# Altium schematic sheet analog_dac.SchDoc
size A3
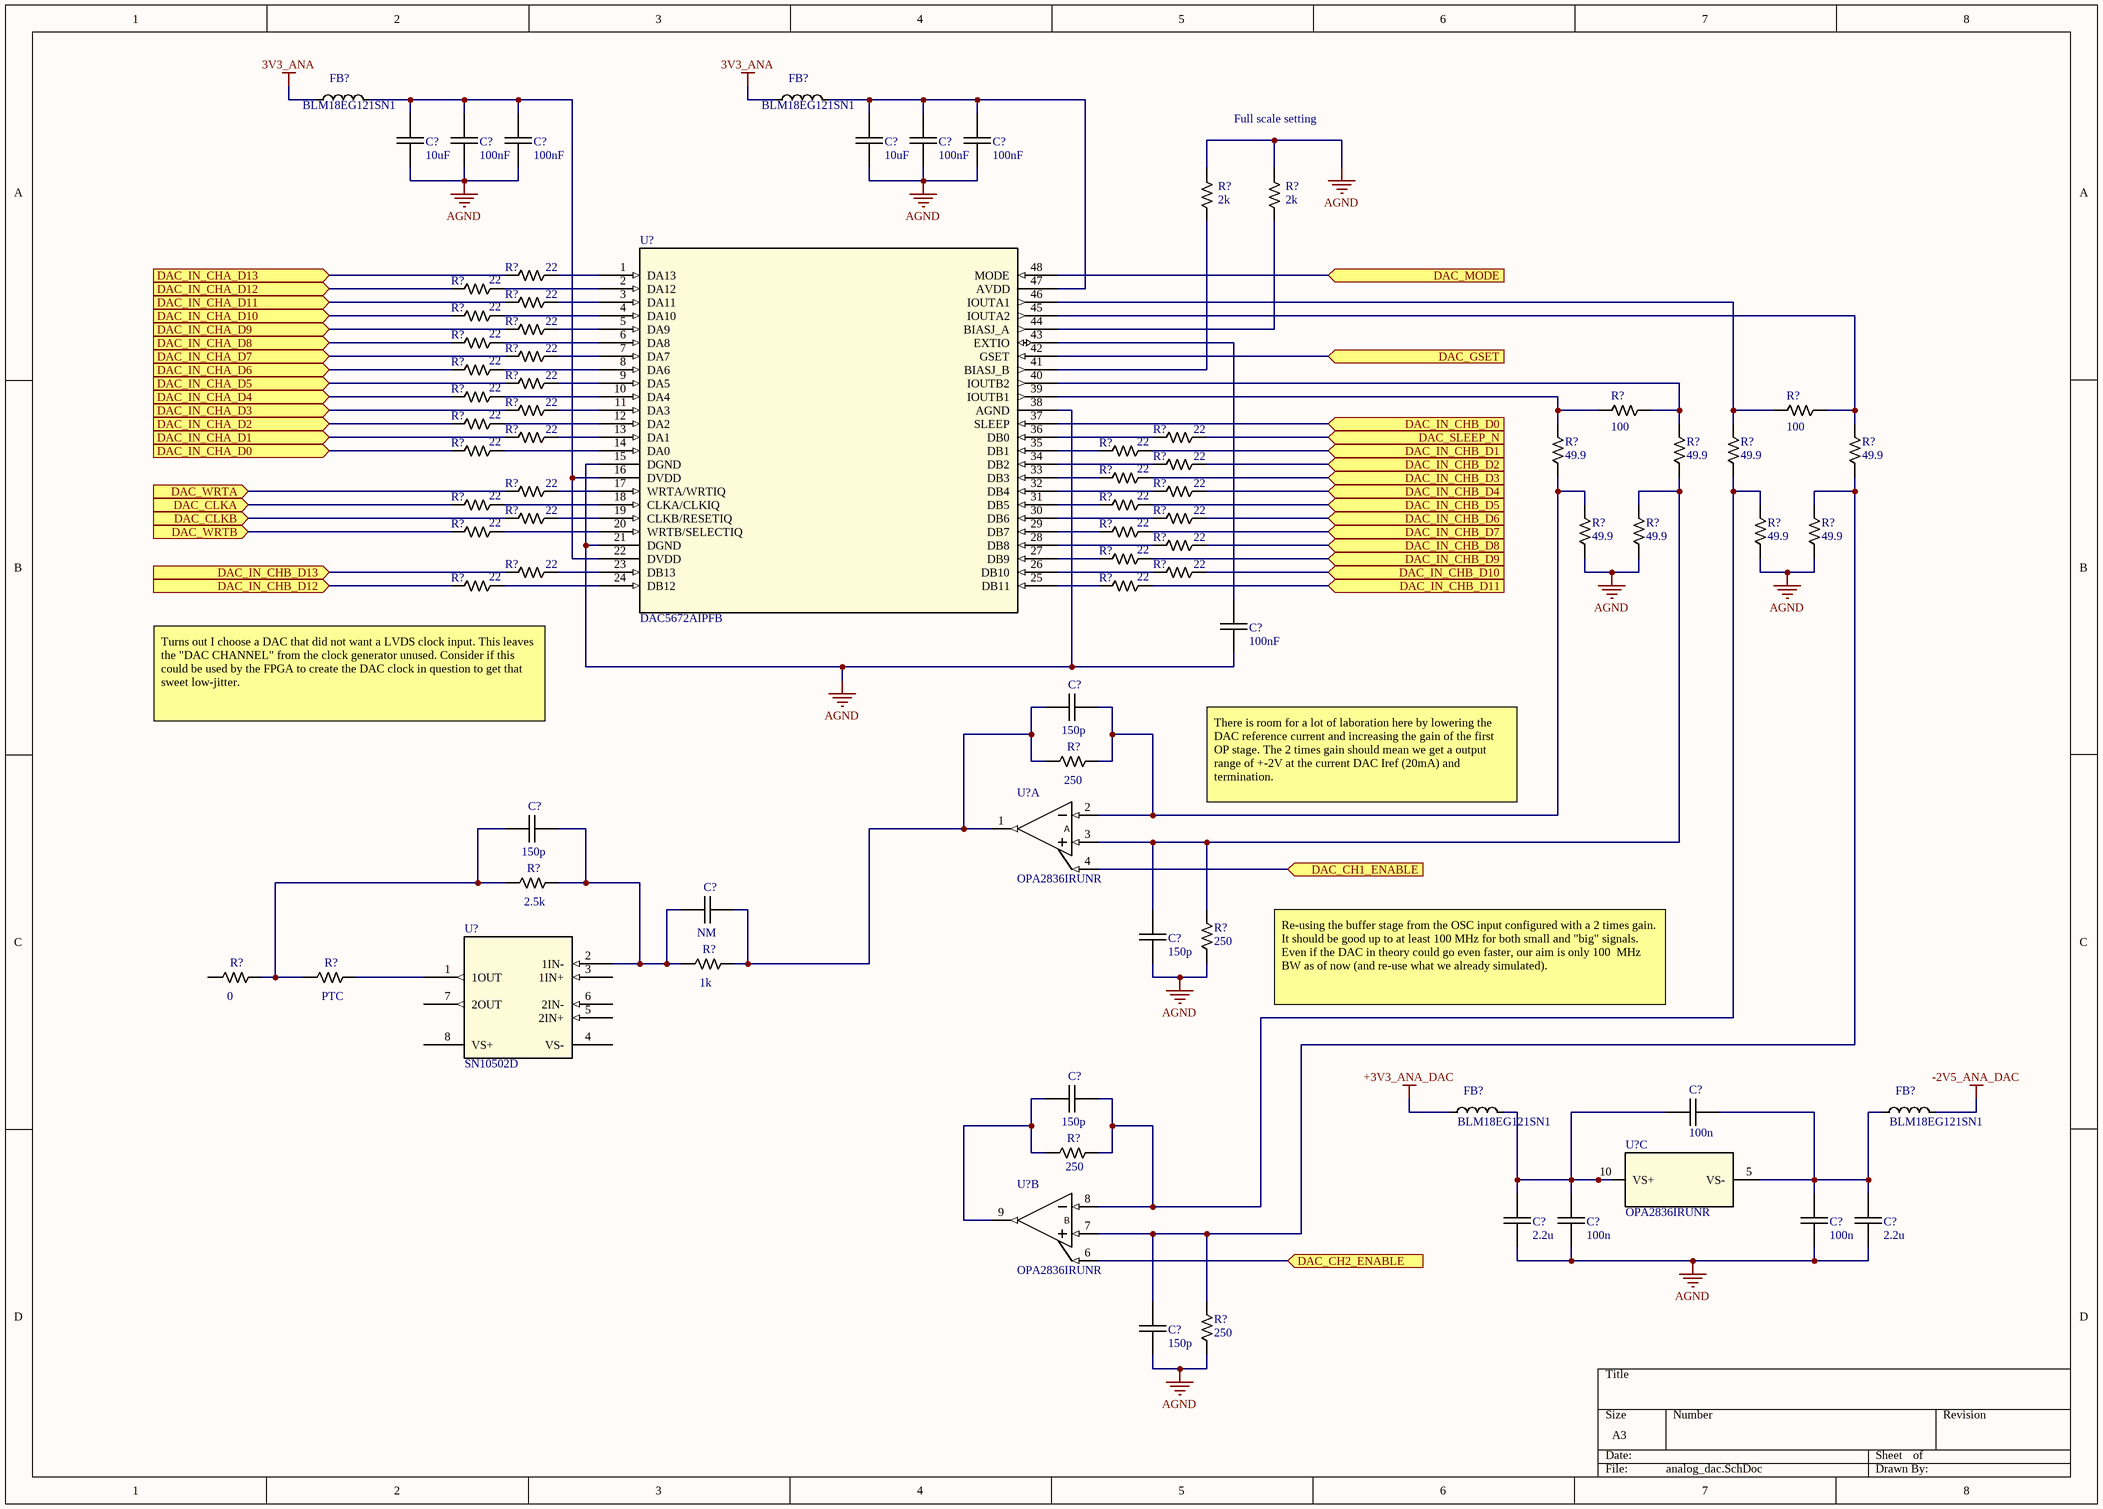
[diagram p0: analog_dac.SchDoc]

## Parts
(Parts that share a designator on the sheet are numbered #1, #2 ... from top to bottom, then left to right.)
C?#1  value 10uF  [CAPC2012X14N]  (hidden comment: MLLC Capacitor)
C?#2  value 100nF  [CAPC1005X06N]  (hidden comment: MLLC Capacitor)
C?#3  value 100nF  [CAPC1005X06N]  (hidden comment: MLLC Capacitor)
C?#4  value 10uF  [CAPC2012X14N]  (hidden comment: MLLC Capacitor)
C?#5  value 100nF  [CAPC1005X06N]  (hidden comment: MLLC Capacitor)
C?#6  value 100nF  [CAPC1005X06N]  (hidden comment: MLLC Capacitor)
C?#7  value 100nF  [CAPC1005X06N]  (hidden comment: MLLC Capacitor)
C?#8  value 150p  [CAPC1005X06N]  (hidden comment: MLLC Capacitor)
C?#9  value 150p  [CAPC1005X06N]  (hidden comment: MLLC Capacitor)
C?#10  value NM  [CAPC1005X06N]  (hidden comment: MLLC Capacitor)
C?#11  value 150p  [CAPC1005X06N]  (hidden comment: MLLC Capacitor)
C?#12  value 150p  [CAPC1005X06N]  (hidden comment: MLLC Capacitor)
C?#13  value 100n  [CAPC1005X06N]  (hidden comment: MLLC Capacitor)
C?#14  value 2.2u  [CAPC1005X06N]  (hidden comment: MLLC Capacitor)
C?#15  value 100n  [CAPC1005X06N]  (hidden comment: MLLC Capacitor)
C?#16  value 100n  [CAPC1005X06N]  (hidden comment: MLLC Capacitor)
C?#17  value 2.2u  [CAPC1005X06N]  (hidden comment: MLLC Capacitor)
C?#18  value 150p  [CAPC1005X06N]  (hidden comment: MLLC Capacitor)
FB?#1  value BLM18EG121SN1  [INDC1608X08N]  (hidden comment: Chip Inductor)
FB?#2  value BLM18EG121SN1  [INDC1608X08N]  (hidden comment: Chip Inductor)
FB?#3  value BLM18EG121SN1  [INDC1608X08N]  (hidden comment: Chip Inductor)
FB?#4  value BLM18EG121SN1  [INDC1608X08N]  (hidden comment: Chip Inductor)
R?#1  value 2k  [RESC1005X04N]  (hidden comment: Chip Resistor)
R?#2  value 2k  [RESC1005X04N]  (hidden comment: Chip Resistor)
R?#3  value 22  [RESC1005X04N]  (hidden comment: Chip Resistor)
R?#4  value 22  [RESC1005X04N]  (hidden comment: Chip Resistor)
R?#5  value 22  [RESC1005X04N]  (hidden comment: Chip Resistor)
R?#6  value 22  [RESC1005X04N]  (hidden comment: Chip Resistor)
R?#7  value 22  [RESC1005X04N]  (hidden comment: Chip Resistor)
R?#8  value 22  [RESC1005X04N]  (hidden comment: Chip Resistor)
R?#9  value 22  [RESC1005X04N]  (hidden comment: Chip Resistor)
R?#10  value 22  [RESC1005X04N]  (hidden comment: Chip Resistor)
R?#11  value 22  [RESC1005X04N]  (hidden comment: Chip Resistor)
R?#12  value 22  [RESC1005X04N]  (hidden comment: Chip Resistor)
R?#13  value 22  [RESC1005X04N]  (hidden comment: Chip Resistor)
R?#14  value 100  [RESC1005X04N]  (hidden comment: Chip Resistor)
R?#15  value 100  [RESC1005X04N]  (hidden comment: Chip Resistor)
R?#16  value 22  [RESC1005X04N]  (hidden comment: Chip Resistor)
R?#17  value 22  [RESC1005X04N]  (hidden comment: Chip Resistor)
R?#18  value 22  [RESC1005X04N]  (hidden comment: Chip Resistor)
R?#19  value 22  [RESC1005X04N]  (hidden comment: Chip Resistor)
R?#20  value 22  [RESC1005X04N]  (hidden comment: Chip Resistor)
R?#21  value 49.9  [RESC1005X04N]  (hidden comment: Chip Resistor)
R?#22  value 49.9  [RESC1005X04N]  (hidden comment: Chip Resistor)
R?#23  value 49.9  [RESC1005X04N]  (hidden comment: Chip Resistor)
R?#24  value 49.9  [RESC1005X04N]  (hidden comment: Chip Resistor)
R?#25  value 22  [RESC1005X04N]  (hidden comment: Chip Resistor)
R?#26  value 22  [RESC1005X04N]  (hidden comment: Chip Resistor)
R?#27  value 22  [RESC1005X04N]  (hidden comment: Chip Resistor)
R?#28  value 22  [RESC1005X04N]  (hidden comment: Chip Resistor)
R?#29  value 22  [RESC1005X04N]  (hidden comment: Chip Resistor)
R?#30  value 22  [RESC1005X04N]  (hidden comment: Chip Resistor)
R?#31  value 22  [RESC1005X04N]  (hidden comment: Chip Resistor)
R?#32  value 22  [RESC1005X04N]  (hidden comment: Chip Resistor)
R?#33  value 22  [RESC1005X04N]  (hidden comment: Chip Resistor)
R?#34  value 22  [RESC1005X04N]  (hidden comment: Chip Resistor)
R?#35  value 49.9  [RESC1005X04N]  (hidden comment: Chip Resistor)
R?#36  value 49.9  [RESC1005X04N]  (hidden comment: Chip Resistor)
R?#37  value 49.9  [RESC1005X04N]  (hidden comment: Chip Resistor)
R?#38  value 49.9  [RESC1005X04N]  (hidden comment: Chip Resistor)
R?#39  value 22  [RESC1005X04N]  (hidden comment: Chip Resistor)
R?#40  value 22  [RESC1005X04N]  (hidden comment: Chip Resistor)
R?#41  value 22  [RESC1005X04N]  (hidden comment: Chip Resistor)
R?#42  value 22  [RESC1005X04N]  (hidden comment: Chip Resistor)
R?#43  value 22  [RESC1005X04N]  (hidden comment: Chip Resistor)
R?#44  value 22  [RESC1005X04N]  (hidden comment: Chip Resistor)
R?#45  value 250  [RESC1005X04N]  (hidden comment: Chip Resistor)
R?#46  value 2.5k  [RESC1005X04N]  (hidden comment: Chip Resistor)
R?#47  value 250  [RESC1005X04N]  (hidden comment: Chip Resistor)
R?#48  value 1k  [RESC1005X04N]  (hidden comment: Chip Resistor)
R?#49  value 0  [RESC1005X04N]  (hidden comment: Chip Resistor)
R?#50  value PTC  [RESC1005X04N]  (hidden comment: Chip Resistor)
R?#51  value 250  [RESC1005X04N]  (hidden comment: Chip Resistor)
R?#52  value 250  [RESC1005X04N]  (hidden comment: Chip Resistor)
U?#1  DAC5672AIPFB  [PFB48]
U?#2  OPA2836IRUNR  [RUN0010A]  (part A of 3)
U?#3  SN10502D  [D8]
U?#4  OPA2836IRUNR  [RUN0010A]  (part C of 3)
U?#5  OPA2836IRUNR  [RUN0010A]  (part B of 3)

## Ports
DAC_CH1_ENABLE (in), DAC_CH2_ENABLE (in), DAC_CLKA (in), DAC_CLKB (in), DAC_GSET (in), DAC_IN_CHA_D0 (in), DAC_IN_CHA_D1 (in), DAC_IN_CHA_D2 (in), DAC_IN_CHA_D3 (in), DAC_IN_CHA_D4 (in), DAC_IN_CHA_D5 (in), DAC_IN_CHA_D6 (in), DAC_IN_CHA_D7 (in), DAC_IN_CHA_D8 (in), DAC_IN_CHA_D9 (in), DAC_IN_CHA_D10 (in), DAC_IN_CHA_D11 (in), DAC_IN_CHA_D12 (in), DAC_IN_CHA_D13 (in), DAC_IN_CHB_D0 (in), DAC_IN_CHB_D1 (in), DAC_IN_CHB_D2 (in), DAC_IN_CHB_D3 (in), DAC_IN_CHB_D4 (in), DAC_IN_CHB_D5 (in), DAC_IN_CHB_D6 (in), DAC_IN_CHB_D7 (in), DAC_IN_CHB_D8 (in), DAC_IN_CHB_D9 (in), DAC_IN_CHB_D10 (in), DAC_IN_CHB_D11 (in), DAC_IN_CHB_D12 (in), DAC_IN_CHB_D13 (in), DAC_MODE (in), DAC_SLEEP_N (in), DAC_WRTA (in), DAC_WRTB (in)

## Nets
3V3_ANA: FB?#1.1 FB?#2.1
+3V3_ANA_DAC: FB?#3.1
-2V5_ANA_DAC: FB?#4.2
AGND: C?#1.2 C?#2.2 C?#3.2 C?#4.2 C?#5.2 C?#6.2 C?#7.2 C?#11.1 C?#14.1 C?#15.1 C?#16.1 C?#17.1 C?#18.1 R?#1.1 R?#2.1 R?#35.1 R?#36.1 R?#37.1 R?#38.1 R?#47.1 R?#52.1 U?#1.15(DGND) U?#1.21(DGND) U?#1.38(AGND)
DAC_CH1_ENABLE: U?#2.4(PD1_N) ; port DAC_CH1_ENABLE
DAC_CH2_ENABLE: U?#5.6(PD2_N) ; port DAC_CH2_ENABLE
DAC_CLKA: R?#29.2 ; port DAC_CLKA
DAC_CLKB: R?#31.2 ; port DAC_CLKB
DAC_GSET: U?#1.42(GSET) ; port DAC_GSET
DAC_IN_CHA_D0: R?#19.2 ; port DAC_IN_CHA_D0
DAC_IN_CHA_D1: R?#17.2 ; port DAC_IN_CHA_D1
DAC_IN_CHA_D2: R?#16.2 ; port DAC_IN_CHA_D2
DAC_IN_CHA_D3: R?#13.2 ; port DAC_IN_CHA_D3
DAC_IN_CHA_D4: R?#12.2 ; port DAC_IN_CHA_D4
DAC_IN_CHA_D5: R?#11.2 ; port DAC_IN_CHA_D5
DAC_IN_CHA_D6: R?#10.2 ; port DAC_IN_CHA_D6
DAC_IN_CHA_D7: R?#9.2 ; port DAC_IN_CHA_D7
DAC_IN_CHA_D8: R?#8.2 ; port DAC_IN_CHA_D8
DAC_IN_CHA_D9: R?#7.2 ; port DAC_IN_CHA_D9
DAC_IN_CHA_D10: R?#6.2 ; port DAC_IN_CHA_D10
DAC_IN_CHA_D11: R?#5.2 ; port DAC_IN_CHA_D11
DAC_IN_CHA_D12: R?#4.2 ; port DAC_IN_CHA_D12
DAC_IN_CHA_D13: R?#3.2 ; port DAC_IN_CHA_D13
DAC_IN_CHB_D0: U?#1.37(SLEEP) ; port DAC_IN_CHB_D0
DAC_IN_CHB_D1: R?#20.1 ; port DAC_IN_CHB_D1
DAC_IN_CHB_D2: R?#25.1 ; port DAC_IN_CHB_D2
DAC_IN_CHB_D3: R?#26.1 ; port DAC_IN_CHB_D3
DAC_IN_CHB_D4: R?#28.1 ; port DAC_IN_CHB_D4
DAC_IN_CHB_D5: R?#30.1 ; port DAC_IN_CHB_D5
DAC_IN_CHB_D6: R?#32.1 ; port DAC_IN_CHB_D6
DAC_IN_CHB_D7: R?#34.1 ; port DAC_IN_CHB_D7
DAC_IN_CHB_D8: R?#39.1 ; port DAC_IN_CHB_D8
DAC_IN_CHB_D9: R?#40.1 ; port DAC_IN_CHB_D9
DAC_IN_CHB_D10: R?#42.1 ; port DAC_IN_CHB_D10
DAC_IN_CHB_D11: R?#44.1 ; port DAC_IN_CHB_D11
DAC_IN_CHB_D12: R?#43.2 ; port DAC_IN_CHB_D12
DAC_IN_CHB_D13: R?#41.2 ; port DAC_IN_CHB_D13
DAC_MODE: U?#1.48(MODE) ; port DAC_MODE
DAC_SLEEP_N: R?#18.1 ; port DAC_SLEEP_N
DAC_WRTA: R?#27.2 ; port DAC_WRTA
DAC_WRTB: R?#33.2 ; port DAC_WRTB
NetC?#1_1: C?#1.1 C?#2.1 C?#3.1 FB?#1.2 U?#1.16(DVDD) U?#1.22(DVDD)
NetC?#4_1: C?#4.1 C?#5.1 C?#6.1 FB?#2.2 U?#1.47(AVDD)
NetC?#7_1: C?#7.1 U?#1.43(EXTIO)
NetC?#8_1: C?#8.1 C?#10.2 R?#45.1 R?#48.2 U?#2.1(VOUT1)
NetC?#8_2: C?#8.2 R?#21.1 R?#35.2 R?#45.2 U?#2.2(IN-)
NetC?#9_1: C?#9.1 R?#46.1 R?#49.2 R?#50.1
NetC?#9_2: C?#9.2 C?#10.1 R?#46.2 R?#48.1 U?#3.2(1IN-)
NetC?#11_2: C?#11.2 R?#22.1 R?#36.2 R?#47.2 U?#2.3(IN+)
NetC?#12_1: C?#12.1 R?#51.1 U?#5.9(VOUT2)
NetC?#12_2: C?#12.2 R?#23.1 R?#37.2 R?#51.2 U?#5.8(IN-)
NetC?#13_1: C?#13.1 C?#16.2 C?#17.2 FB?#4.1 U?#4.5(VS-)
NetC?#13_2: C?#13.2 C?#14.2 C?#15.2 FB?#3.2 U?#4.10(VS+)
NetC?#18_2: C?#18.2 R?#24.1 R?#38.2 R?#52.2 U?#5.7(IN+)
NetR?#1_2: R?#1.2 U?#1.41(BIASJ_B)
NetR?#2_2: R?#2.2 U?#1.44(BIASJ_A)
NetR?#3_1: R?#3.1 U?#1.1(DA13)
NetR?#4_1: R?#4.1 U?#1.2(DA12)
NetR?#5_1: R?#5.1 U?#1.3(DA11)
NetR?#6_1: R?#6.1 U?#1.4(DA10)
NetR?#7_1: R?#7.1 U?#1.5(DA9)
NetR?#8_1: R?#8.1 U?#1.6(DA8)
NetR?#9_1: R?#9.1 U?#1.7(DA7)
NetR?#10_1: R?#10.1 U?#1.8(DA6)
NetR?#11_1: R?#11.1 U?#1.9(DA5)
NetR?#12_1: R?#12.1 U?#1.10(DA4)
NetR?#13_1: R?#13.1 U?#1.11(DA3)
NetR?#14_1: R?#14.1 R?#22.2 U?#1.40(IOUTB2)
NetR?#14_2: R?#14.2 R?#21.2 U?#1.39(IOUTB1)
NetR?#15_1: R?#15.1 R?#24.2 U?#1.45(IOUTA2)
NetR?#15_2: R?#15.2 R?#23.2 U?#1.46(IOUTA1)
NetR?#16_1: R?#16.1 U?#1.12(DA2)
NetR?#17_1: R?#17.1 U?#1.13(DA1)
NetR?#18_2: R?#18.2 U?#1.36(DB0)
NetR?#19_1: R?#19.1 U?#1.14(DA0)
NetR?#20_2: R?#20.2 U?#1.35(DB1)
NetR?#25_2: R?#25.2 U?#1.34(DB2)
NetR?#26_2: R?#26.2 U?#1.33(DB3)
NetR?#27_1: R?#27.1 U?#1.17(WRTA/WRTIQ)
NetR?#28_2: R?#28.2 U?#1.32(DB4)
NetR?#29_1: R?#29.1 U?#1.18(CLKA/CLKIQ)
NetR?#30_2: R?#30.2 U?#1.31(DB5)
NetR?#31_1: R?#31.1 U?#1.19(CLKB/RESETIQ)
NetR?#32_2: R?#32.2 U?#1.30(DB6)
NetR?#33_1: R?#33.1 U?#1.20(WRTB/SELECTIQ)
NetR?#34_2: R?#34.2 U?#1.29(DB7)
NetR?#39_2: R?#39.2 U?#1.28(DB8)
NetR?#40_2: R?#40.2 U?#1.27(DB9)
NetR?#41_1: R?#41.1 U?#1.23(DB13)
NetR?#42_2: R?#42.2 U?#1.26(DB10)
NetR?#43_1: R?#43.1 U?#1.24(DB12)
NetR?#44_2: R?#44.2 U?#1.25(DB11)
NetR?#50_2: R?#50.2 U?#3.1(1OUT)

Not connected (* = marked no-connect by the designer): R?#49 1; U?#3 3(1IN+) 4(VS-) 5(2IN+) 6(2IN-) 7(2OUT) 8(VS+)

## Notes on the sheet
- Full scale setting
- (near R?#43) Turns out I choose a DAC that did not want a LVDS clock input. This leaves the "DAC CHANNEL" from the clock generator unused. Consider if this could be used by the FPGA to create the DAC clock in question to get that sweet low-jitter.
- There is room for a lot of laboration here by lowering the DAC reference current and increasing the gain of the first OP stage. The 2 times gain should mean we get a output range of +-2V at the current DAC Iref (20mA) and termination.
- Re-using the buffer stage from the OSC input configured with a 2 times gain. It should be good up to at least 100 MHz for both small and "big" signals. Even if the DAC in theory could go even faster, our aim is only 100  MHz BW as of now (and re-use what we already simulated).
- (in symbol OPA2836IRUNR, part A) A
- (in symbol OPA2836IRUNR, part B) B

## Library data of the parts
C?#1-C?#18 = Cap: Rating: *
FB?#1-FB?#4 = Ind
R?#1-R?#52 = Res
U?#1 = DAC5672A: Dual-Channel, 14-Bit, 275-MSPS Digital-to-Analog Converter (DAC); Manufacturer: Texas Instruments; INDUSTRY_STD_PKG_TYPE: TQFP; FAMILY_NAME: HIGH SPEED DAC (>10MSPS); PIN_COUNT: 48; PACKAGE_DESIGNATOR: PFB; Datasheet_URL: http://www.ti.com/lit/gpn/DAC5672A; GENERIC_PART_NUMBER: DAC5672A; Copyright: Copyright (C) 2018 Accelerated Designs. All rights reserved; RefDes: RefDes; Type: DEV; ComponentLink1Description: Product Page; ComponentLink1URL: https://www.ti.com/product/DAC5672A
U?#2 U?#4 U?#5 = OPA2836IRUNR: Dual, Very Low Power, Rail to Rail out, Negative Rail in, VFB Op Amp, 205MHz BW, 120 MHz GBW; Manufacturer: Texas Instruments; PartNumber: OPA2836IRUNR; RefDes: RefDes; Type: DEV; Value: Value; Copyright: Copyright (C) 2018 Accelerated Designs. All rights reserved; ComponentLink1Description: Product Page; ComponentLink1URL: https://www.ti.com/product/OPA2836
U?#3 = SN10502D: Low-Distortion High-Speed Rail-to-Rail Output Operational Amplifiers; Manufacturer: Texas Instruments; INDUSTRY_STD_PKG_TYPE: SOIC; FAMILY_NAME: VOLTAGE FEEDBACK; PIN_COUNT: 8; PACKAGE_DESIGNATOR: D; Datasheet_URL: http://www.ti.com/lit/gpn/SN10502; GENERIC_PART_NUMBER: SN10502; Vendor: Texas Instruments; Manufacturer_Part_Number: SN10502D; Copyright: Copyright (C) 2018 Accelerated Designs. All rights reserved; RefDes: RefDes; Type: DEV